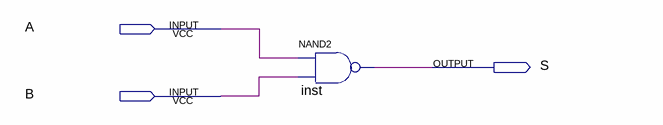
[diagram p0: schematic sheet]
// Quartus schematic Porte_NAND_SCHEME.bdf as structural Verilog: 1 symbols, 3 pins
module Porte_NAND_SCHEME (
  input  A,
  input  B,
  output S
);

  nand inst (S, A, B);
endmodule
